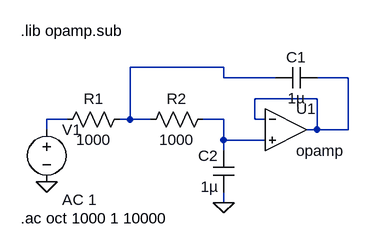
[diagram p0: schematic sallenkey2ndorderlowpassfilter.asc]
sallenkey2ndorderlowpassfilter.asc, the LTspice schematic file:
Version 4
SHEET 1 880 680
WIRE 160 112 16 112
WIRE 160 128 160 112
WIRE 240 128 160 128
WIRE 352 128 304 128
WIRE 304 160 208 160
WIRE -80 192 -112 192
WIRE 16 192 16 112
WIRE 16 192 0 192
WIRE 48 192 16 192
WIRE 160 192 128 192
WIRE 208 192 208 160
WIRE 224 192 208 192
WIRE -112 208 -112 192
WIRE 304 208 304 160
WIRE 304 208 288 208
WIRE 352 208 352 128
WIRE 352 208 304 208
WIRE 160 224 160 192
WIRE 224 224 160 224
WIRE 160 240 160 224
WIRE 160 320 160 304
FLAG 160 320 0
FLAG -112 288 0
SYMBOL cap 304 112 R90
WINDOW 0 0 32 VBottom 2
WINDOW 3 32 32 VTop 2
SYMATTR InstName C1
SYMATTR Value 1µ
SYMBOL cap 176 304 R180
WINDOW 0 24 56 Left 2
WINDOW 3 24 8 Left 2
SYMATTR InstName C2
SYMATTR Value 1µ
SYMBOL Opamps\\opamp 256 144 R0
SYMATTR InstName U1
SYMBOL res 16 176 R90
WINDOW 0 0 56 VBottom 2
WINDOW 3 32 56 VTop 2
SYMATTR InstName R1
SYMATTR Value 1000
SYMBOL res 144 176 R90
WINDOW 0 0 56 VBottom 2
WINDOW 3 32 56 VTop 2
SYMATTR InstName R2
SYMATTR Value 1000
SYMBOL voltage -112 192 R0
WINDOW 123 24 124 Left 2
WINDOW 39 0 0 Left 0
SYMATTR Value2 AC 1
SYMATTR InstName V1
SYMATTR Value ""
TEXT -152 56 Left 2 !.lib opamp.sub
TEXT -152 344 Left 2 !.ac oct 1000 1 10000

The netlist it stands for:
* sallenkey2ndorderlowpassfilter.asc
C1 N002 N001 1µ
C2 0 N004 1µ
XU1 N002 N004 N002 opamp Aol=100K GBW=10Meg  ; pins invin noninvin out
R1 N001 N003 1000
R2 N004 N001 1000
V1 N003 0 AC 1
.lib opamp.sub
.ac oct 1000 1 10000
.backanno
.end